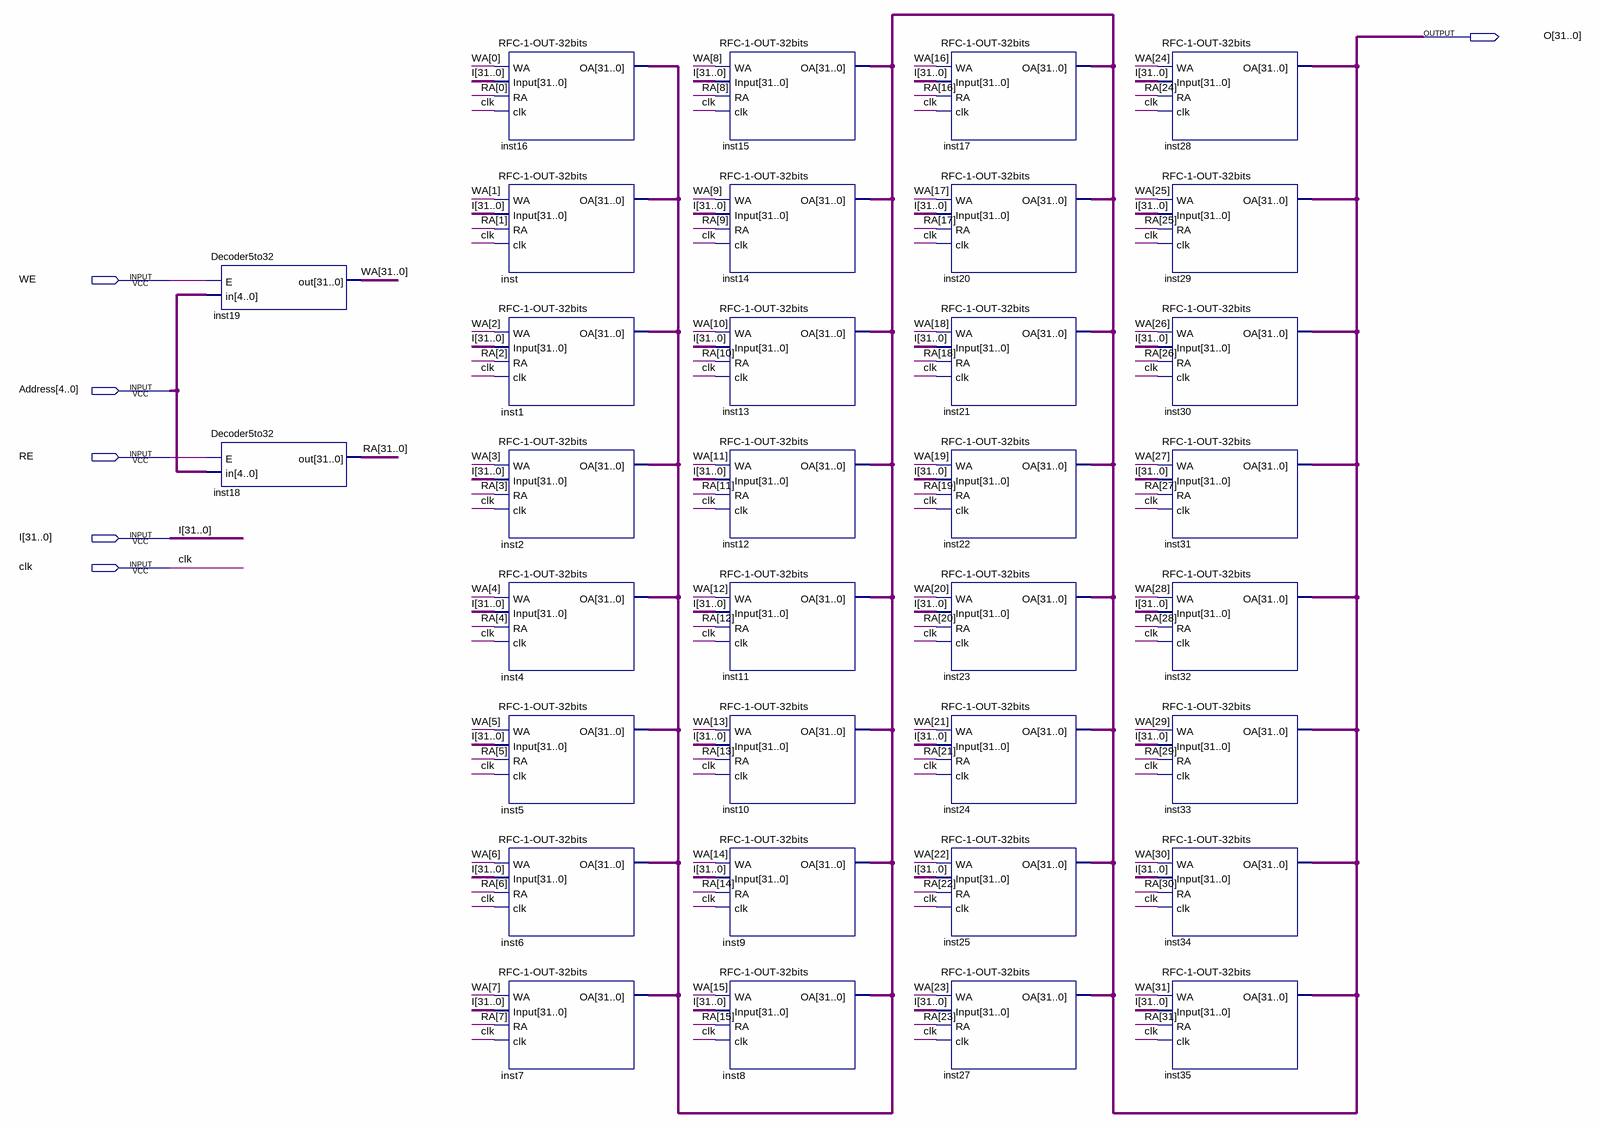
[diagram p0: schematic sheet]
// Quartus schematic DMEM.bdf as structural Verilog: 34 symbols, 6 pins
module DMEM (
  input  WE,
  input  [4:0] Address,
  input  RE,
  input  [31:0] I,
  input  clk,
  output [31:0] O
);

  wire [31:0] RA, WA;

  Decoder5to32 inst19 (.E(WE), .in(Address), .out(WA));
  Decoder5to32 inst18 (.E(RE), .in(Address), .out(RA));
  \RFC-1-OUT-32bits  inst16 (.WA(WA[0]), .Input(I), .RA(RA[0]), .clk(clk), .OA(O));
  \RFC-1-OUT-32bits  inst (.WA(WA[1]), .Input(I), .RA(RA[1]), .clk(clk), .OA(O));
  \RFC-1-OUT-32bits  inst1 (.WA(WA[2]), .Input(I), .RA(RA[2]), .clk(clk), .OA(O));
  \RFC-1-OUT-32bits  inst2 (.WA(WA[3]), .Input(I), .RA(RA[3]), .clk(clk), .OA(O));
  \RFC-1-OUT-32bits  inst4 (.WA(WA[4]), .Input(I), .RA(RA[4]), .clk(clk), .OA(O));
  \RFC-1-OUT-32bits  inst5 (.WA(WA[5]), .Input(I), .RA(RA[5]), .clk(clk), .OA(O));
  \RFC-1-OUT-32bits  inst6 (.WA(WA[6]), .Input(I), .RA(RA[6]), .clk(clk), .OA(O));
  \RFC-1-OUT-32bits  inst7 (.WA(WA[7]), .Input(I), .RA(RA[7]), .clk(clk), .OA(O));
  \RFC-1-OUT-32bits  inst15 (.WA(WA[8]), .Input(I), .RA(RA[8]), .clk(clk), .OA(O));
  \RFC-1-OUT-32bits  inst14 (.WA(WA[9]), .Input(I), .RA(RA[9]), .clk(clk), .OA(O));
  \RFC-1-OUT-32bits  inst13 (.WA(WA[10]), .Input(I), .RA(RA[10]), .clk(clk), .OA(O));
  \RFC-1-OUT-32bits  inst12 (.WA(WA[11]), .Input(I), .RA(RA[11]), .clk(clk), .OA(O));
  \RFC-1-OUT-32bits  inst11 (.WA(WA[12]), .Input(I), .RA(RA[12]), .clk(clk), .OA(O));
  \RFC-1-OUT-32bits  inst10 (.WA(WA[13]), .Input(I), .RA(RA[13]), .clk(clk), .OA(O));
  \RFC-1-OUT-32bits  inst9 (.WA(WA[14]), .Input(I), .RA(RA[14]), .clk(clk), .OA(O));
  \RFC-1-OUT-32bits  inst8 (.WA(WA[15]), .Input(I), .RA(RA[15]), .clk(clk), .OA(O));
  \RFC-1-OUT-32bits  inst17 (.WA(WA[16]), .Input(I), .RA(RA[16]), .clk(clk), .OA(O));
  \RFC-1-OUT-32bits  inst20 (.WA(WA[17]), .Input(I), .RA(RA[17]), .clk(clk), .OA(O));
  \RFC-1-OUT-32bits  inst21 (.WA(WA[18]), .Input(I), .RA(RA[18]), .clk(clk), .OA(O));
  \RFC-1-OUT-32bits  inst22 (.WA(WA[19]), .Input(I), .RA(RA[19]), .clk(clk), .OA(O));
  \RFC-1-OUT-32bits  inst23 (.WA(WA[20]), .Input(I), .RA(RA[20]), .clk(clk), .OA(O));
  \RFC-1-OUT-32bits  inst24 (.WA(WA[21]), .Input(I), .RA(RA[21]), .clk(clk), .OA(O));
  \RFC-1-OUT-32bits  inst25 (.WA(WA[22]), .Input(I), .RA(RA[22]), .clk(clk), .OA(O));
  \RFC-1-OUT-32bits  inst27 (.WA(WA[23]), .Input(I), .RA(RA[23]), .clk(clk), .OA(O));
  \RFC-1-OUT-32bits  inst28 (.WA(WA[24]), .Input(I), .RA(RA[24]), .clk(clk), .OA(O));
  \RFC-1-OUT-32bits  inst29 (.WA(WA[25]), .Input(I), .RA(RA[25]), .clk(clk), .OA(O));
  \RFC-1-OUT-32bits  inst30 (.WA(WA[26]), .Input(I), .RA(RA[26]), .clk(clk), .OA(O));
  \RFC-1-OUT-32bits  inst31 (.WA(WA[27]), .Input(I), .RA(RA[27]), .clk(clk), .OA(O));
  \RFC-1-OUT-32bits  inst32 (.WA(WA[28]), .Input(I), .RA(RA[28]), .clk(clk), .OA(O));
  \RFC-1-OUT-32bits  inst33 (.WA(WA[29]), .Input(I), .RA(RA[29]), .clk(clk), .OA(O));
  \RFC-1-OUT-32bits  inst34 (.WA(WA[30]), .Input(I), .RA(RA[30]), .clk(clk), .OA(O));
  \RFC-1-OUT-32bits  inst35 (.WA(WA[31]), .Input(I), .RA(RA[31]), .clk(clk), .OA(O));
endmodule
